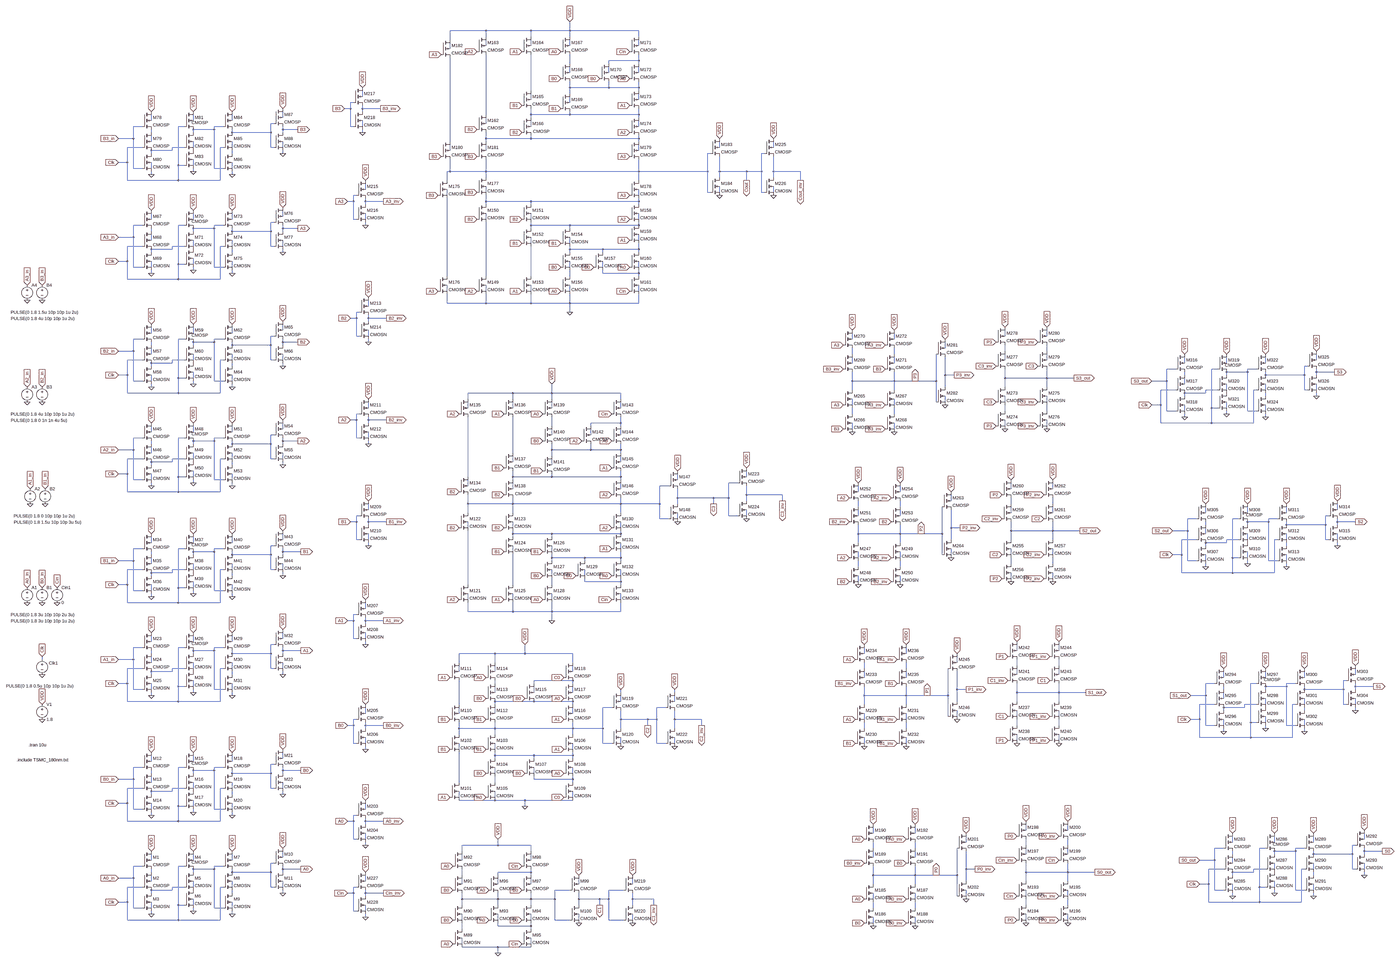
[diagram p0: schematic cla_adder_static_logic_optimized_1.asc, whole sheet]
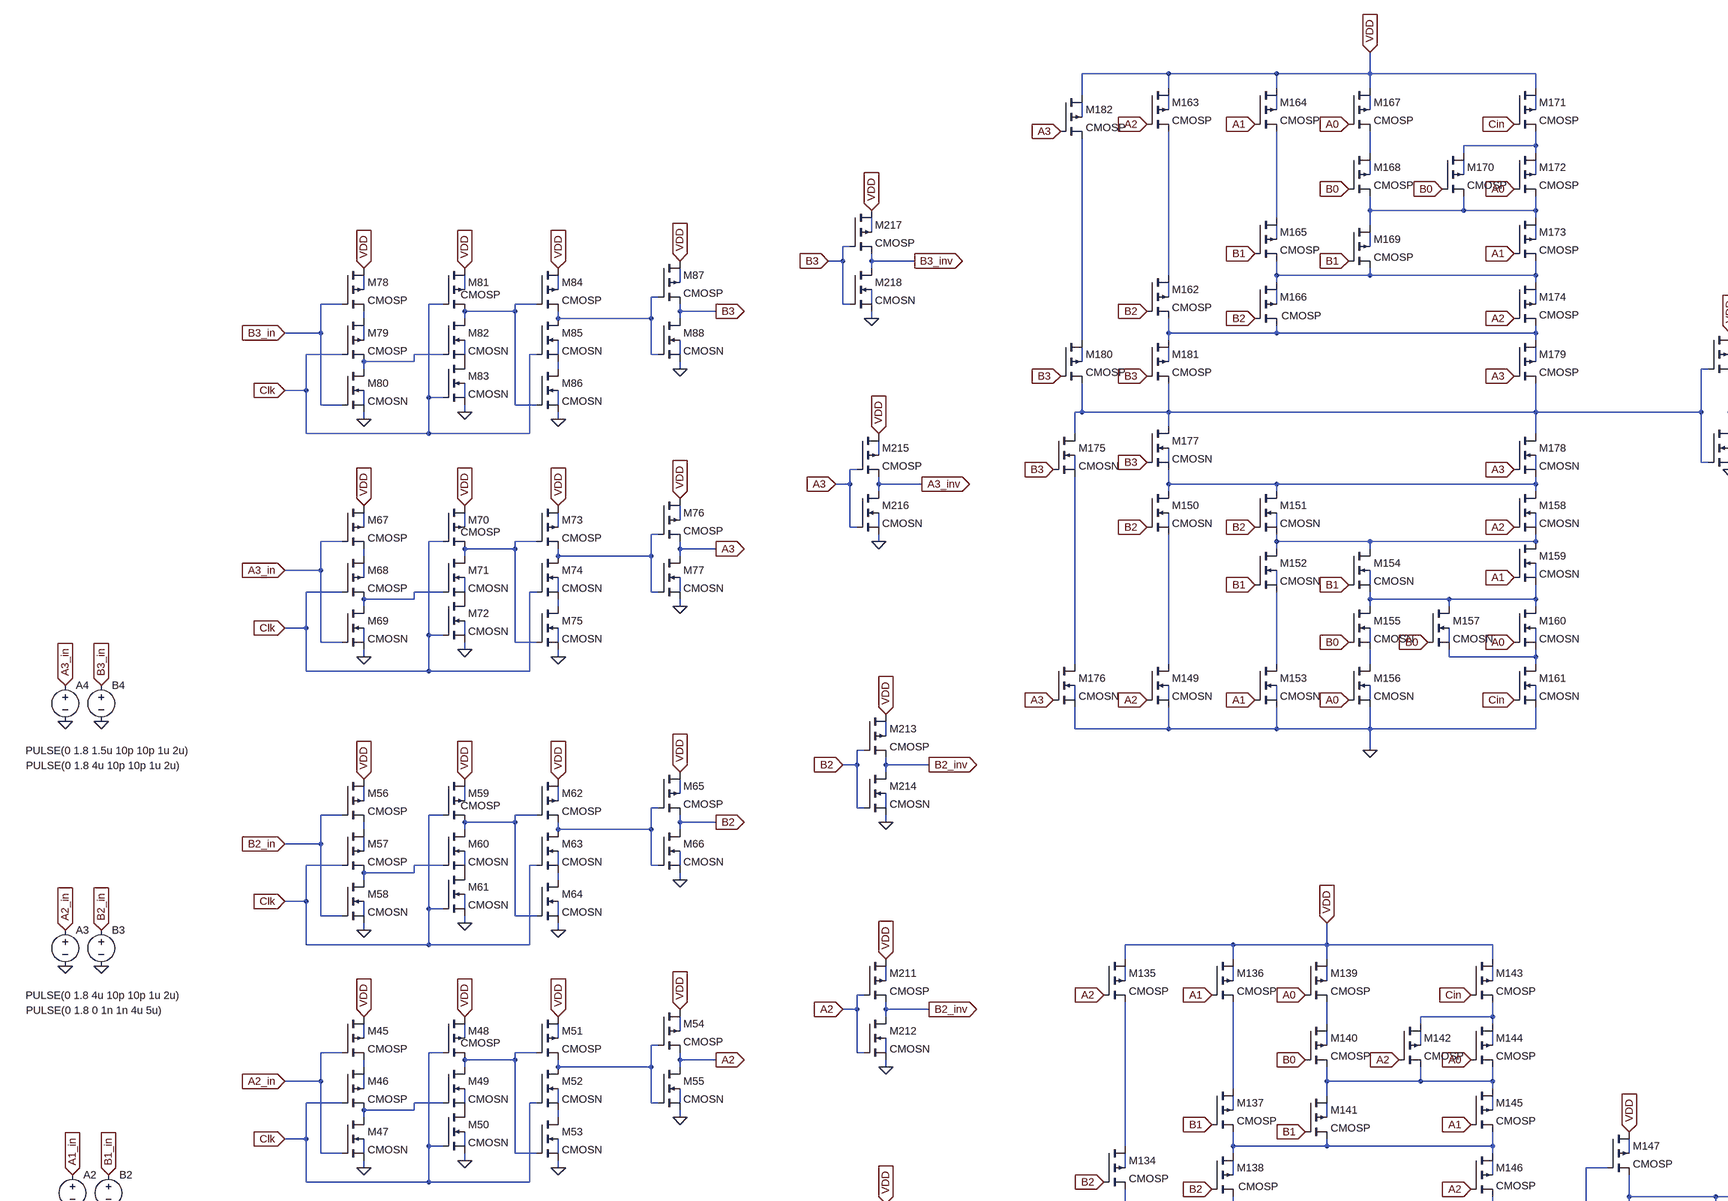
[diagram p1: schematic cla_adder_static_logic_optimized_1.asc, part, row 1 of 2, column 1 of 2]
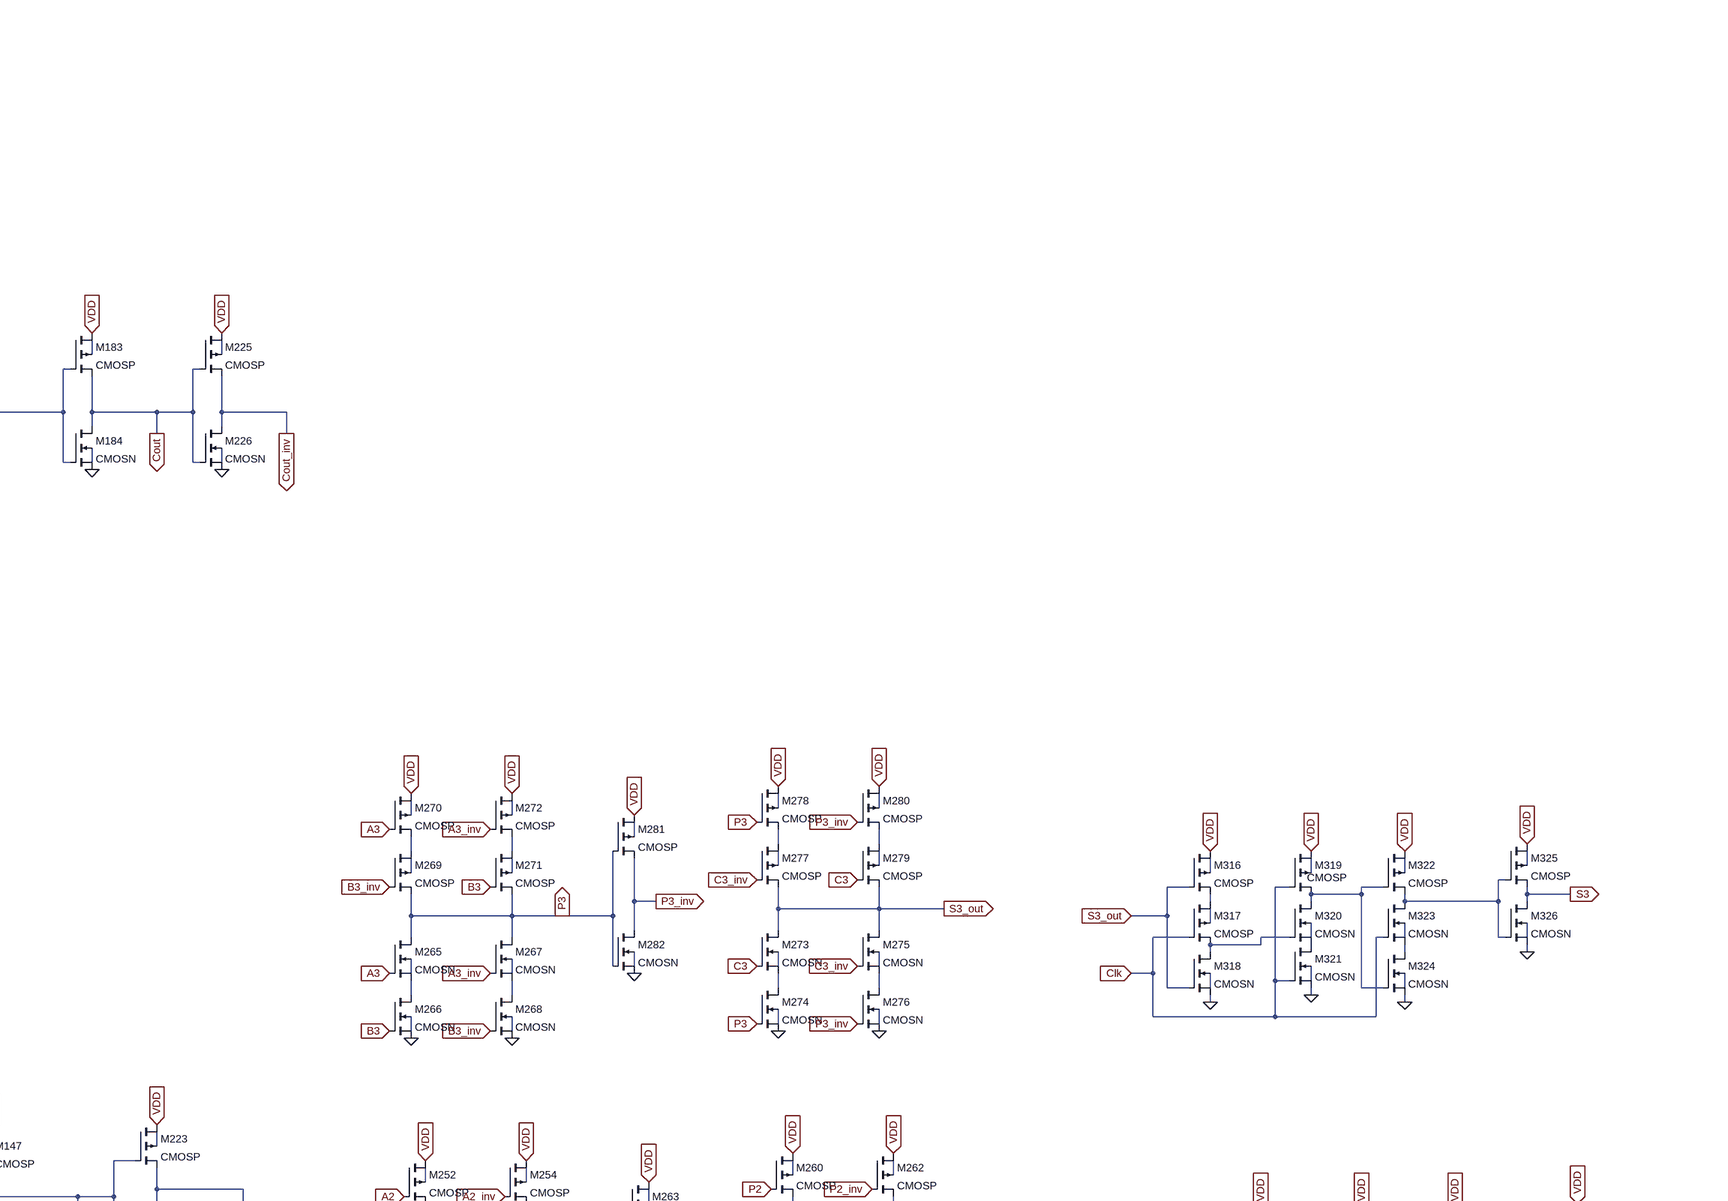
[diagram p2: schematic cla_adder_static_logic_optimized_1.asc, part, row 1 of 2, column 2 of 2]
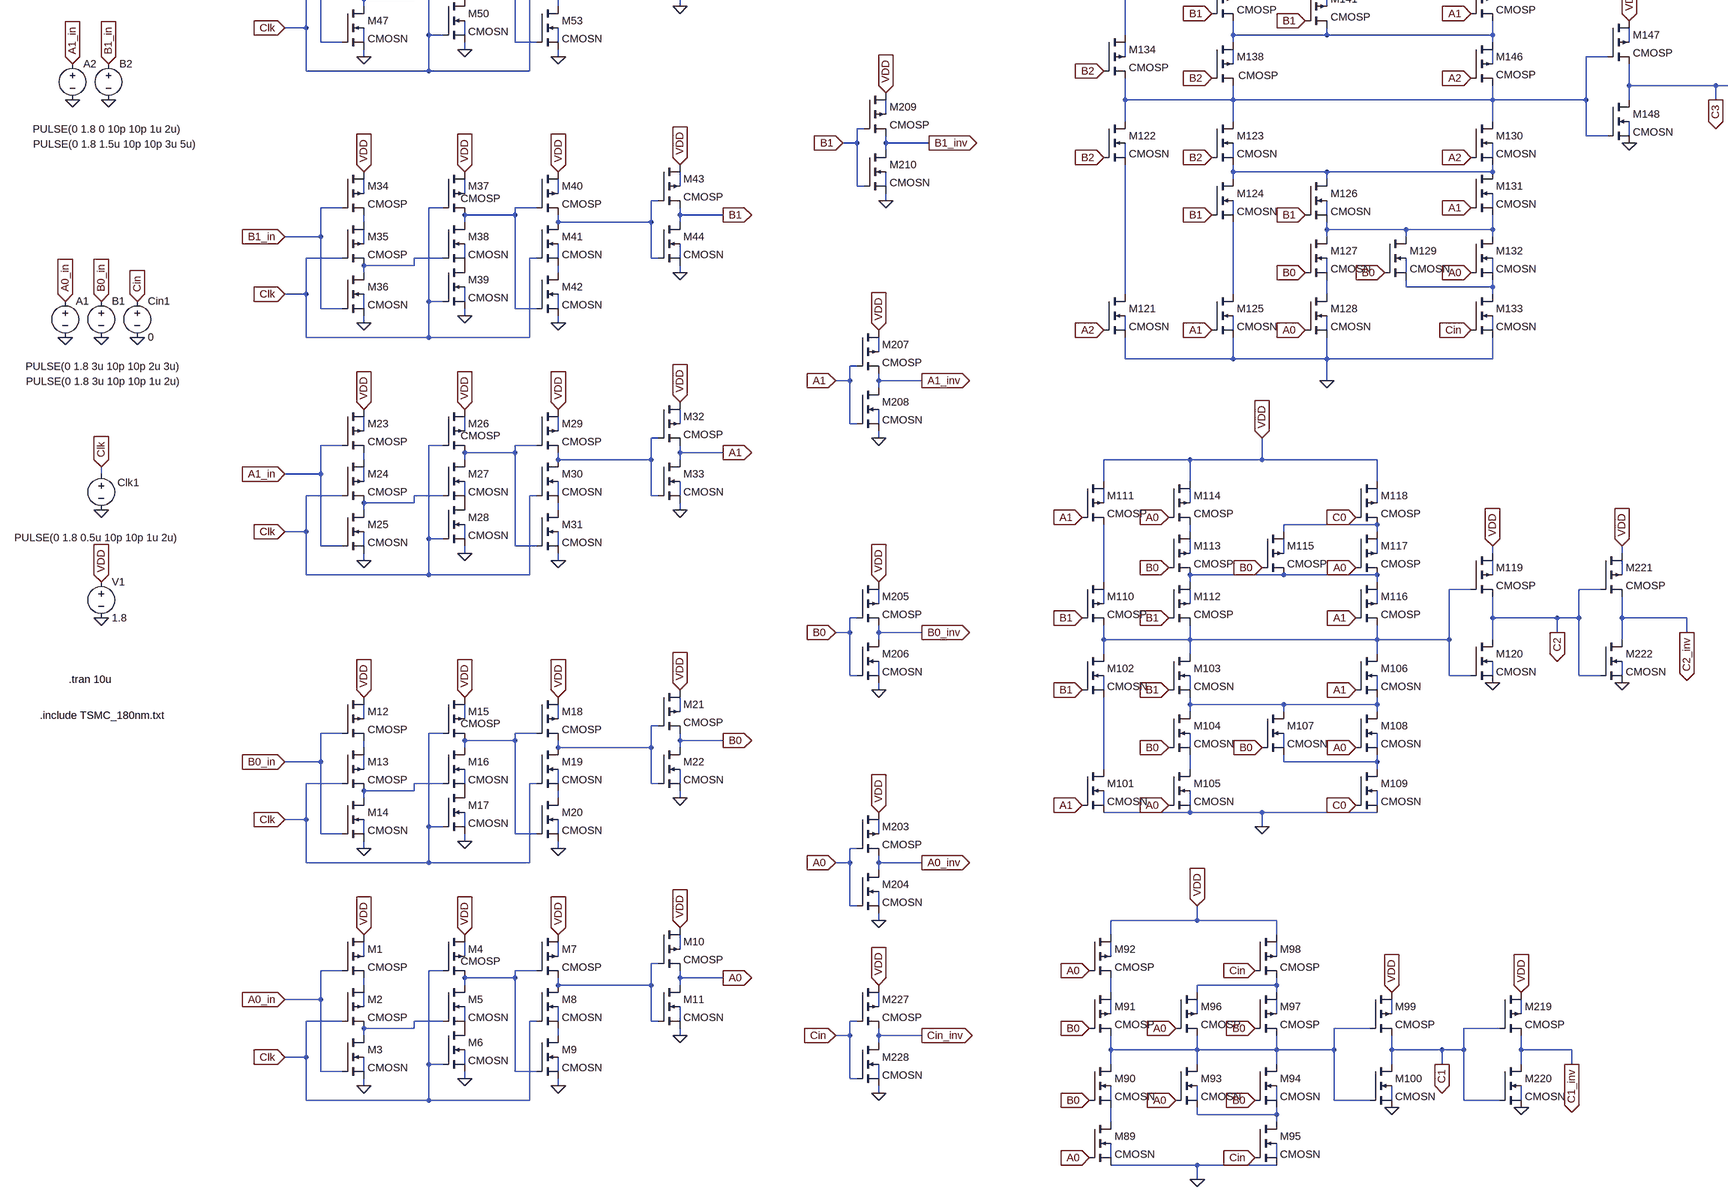
[diagram p3: schematic cla_adder_static_logic_optimized_1.asc, part, row 2 of 2, column 1 of 2]
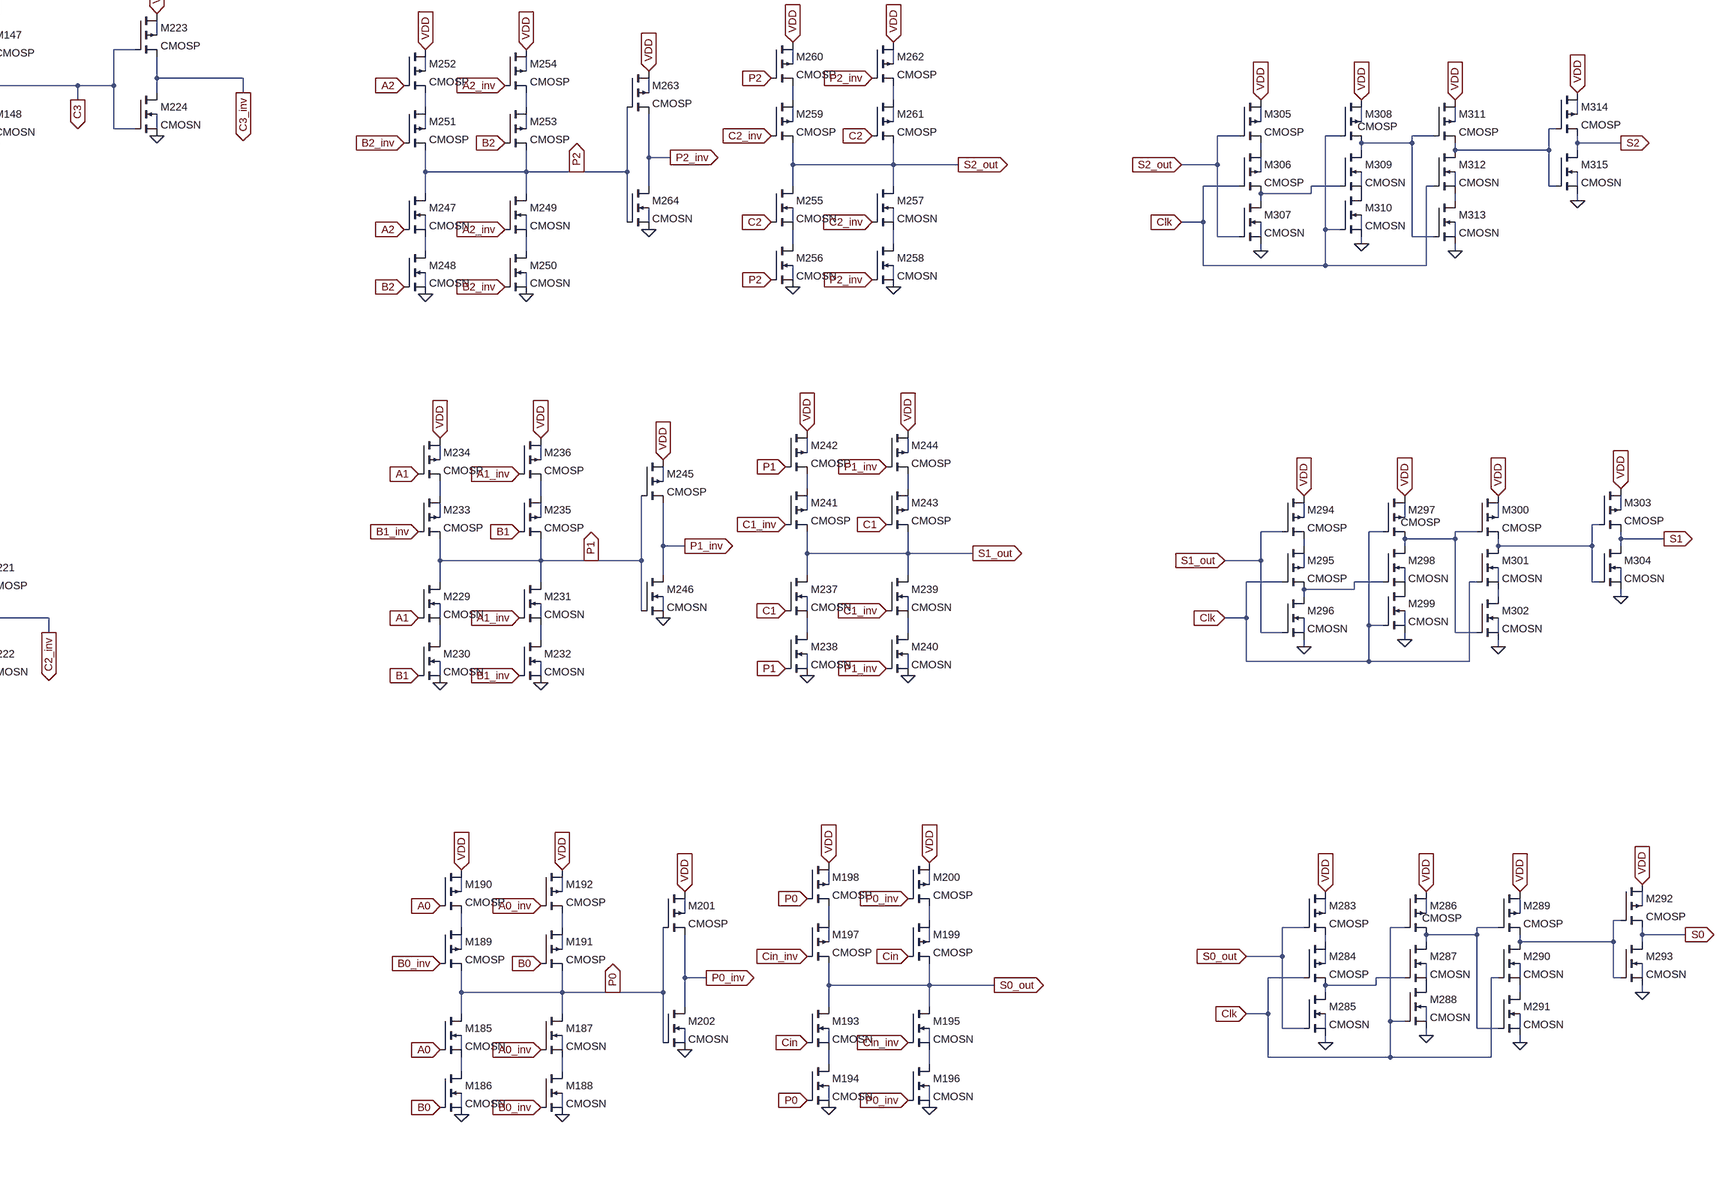
[diagram p4: schematic cla_adder_static_logic_optimized_1.asc, part, row 2 of 2, column 2 of 2]
* cla_adder_static_logic_optimized_1.asc
V§B1 B0_in 0 PULSE(0 1.8 3u 10p 10p 1u 2u)
V§Cin1 Cin 0 0
V§A1 A0_in 0 PULSE(0 1.8 3u 10p 10p 2u 3u)
V§B2 B1_in 0 PULSE(0 1.8 1.5u 10p 10p 3u 5u)
V§A2 A1_in 0 PULSE(0 1.8 0 10p 10p 1u 2u)
V§B3 B2_in 0 PULSE(0 1.8 0 1n 1n 4u 5u)
V§A3 A2_in 0 PULSE(0 1.8 4u 10p 10p 1u 2u)
V§B4 B3_in 0 PULSE(0 1.8 4u 10p 10p 1u 2u)
V§A4 A3_in 0 PULSE(0 1.8 1.5u 10p 10p 1u 2u)
V§Clk1 Clk 0 PULSE(0 1.8 0.5u 10p 10p 1u 2u)
V1 VDD 0 1.8
M1 VDD A0_in N417 N405 CMOSP l=0.18u w=3.6u
M2 N417 Clk N428 N421 CMOSP l=0.18u w=3.6u
M3 N428 A0_in 0 N445 CMOSN l=0.18u w=1.8u
M4 VDD Clk N412 N406 CMOSP l=0.18u w=3.6u
M5 N412 N428 P001 N429 CMOSN l=0.18u w=1.8u
M6 P001 Clk 0 N442 CMOSN l=0.18u w=1.8u
M7 VDD N412 N410 N407 CMOSP l=0.18u w=3.6u
M8 N410 Clk N436 N430 CMOSN l=0.18u w=1.8u
M9 N436 N412 0 N446 CMOSN l=0.18u w=1.8u
M10 VDD N410 A0 N402 CMOSP l=0.18u w=3.6u
M11 A0 N410 0 N431 CMOSN l=0.18u w=1.8u
M12 VDD B0_in N363 N358 CMOSP l=0.18u w=3.6u
M13 N363 Clk N371 N368 CMOSP l=0.18u w=3.6u
M14 N371 B0_in 0 N380 CMOSN l=0.18u w=1.8u
M15 VDD Clk N362 N359 CMOSP l=0.18u w=3.6u
M16 N362 N371 P002 N372 CMOSN l=0.18u w=1.8u
M17 P002 Clk 0 N379 CMOSN l=0.18u w=1.8u
M18 VDD N362 N361 N360 CMOSP l=0.18u w=3.6u
M19 N361 Clk N375 N373 CMOSN l=0.18u w=1.8u
M20 N375 N362 0 N381 CMOSN l=0.18u w=1.8u
M21 VDD N361 B0 N357 CMOSP l=0.18u w=3.6u
M22 B0 N361 0 N374 CMOSN l=0.18u w=1.8u
M23 VDD A1_in N283 N276 CMOSP l=0.18u w=3.6u
M24 N283 Clk N290 N286 CMOSP l=0.18u w=3.6u
M25 N290 A1_in 0 N313 CMOSN l=0.18u w=1.8u
M26 VDD Clk N280 N277 CMOSP l=0.18u w=3.6u
M27 N280 N290 P003 N291 CMOSN l=0.18u w=1.8u
M28 P003 Clk 0 N312 CMOSN l=0.18u w=1.8u
M29 VDD N280 N279 N278 CMOSP l=0.18u w=3.6u
M30 N279 Clk N299 N292 CMOSN l=0.18u w=1.8u
M31 N299 N280 0 N314 CMOSN l=0.18u w=1.8u
M32 VDD N279 A1 N274 CMOSP l=0.18u w=3.6u
M33 A1 N279 0 N293 CMOSN l=0.18u w=1.8u
M34 VDD B1_in N235 N226 CMOSP l=0.18u w=3.6u
M35 N235 Clk N250 N245 CMOSP l=0.18u w=3.6u
M36 N250 B1_in 0 N267 CMOSN l=0.18u w=1.8u
M37 VDD Clk N231 N227 CMOSP l=0.18u w=3.6u
M38 N231 N250 P004 N251 CMOSN l=0.18u w=1.8u
M39 P004 Clk 0 N266 CMOSN l=0.18u w=1.8u
M40 VDD N231 N229 N228 CMOSP l=0.18u w=3.6u
M41 N229 Clk N254 N252 CMOSN l=0.18u w=1.8u
M42 N254 N231 0 N268 CMOSN l=0.18u w=1.8u
M43 VDD N229 B1 N220 CMOSP l=0.18u w=3.6u
M44 B1 N229 0 N253 CMOSN l=0.18u w=1.8u
M45 VDD A2_in N169 N160 CMOSP l=0.18u w=3.6u
M46 N169 Clk N173 N171 CMOSP l=0.18u w=3.6u
M47 N173 A2_in 0 N185 CMOSN l=0.18u w=1.8u
M48 VDD Clk N167 N161 CMOSP l=0.18u w=3.6u
M49 N167 N173 P005 N174 CMOSN l=0.18u w=1.8u
M50 P005 Clk 0 N181 CMOSN l=0.18u w=1.8u
M51 VDD N167 N163 N162 CMOSP l=0.18u w=3.6u
M52 N163 Clk N179 N175 CMOSN l=0.18u w=1.8u
M53 N179 N167 0 N186 CMOSN l=0.18u w=1.8u
M54 VDD N163 A2 N157 CMOSP l=0.18u w=3.6u
M55 A2 N163 0 N176 CMOSN l=0.18u w=1.8u
M56 VDD B2_in N104 N094 CMOSP l=0.18u w=3.6u
M57 N104 Clk N111 N108 CMOSP l=0.18u w=3.6u
M58 N111 B2_in 0 N128 CMOSN l=0.18u w=1.8u
M59 VDD Clk N101 N095 CMOSP l=0.18u w=3.6u
M60 N101 N111 P006 N112 CMOSN l=0.18u w=1.8u
M61 P006 Clk 0 N127 CMOSN l=0.18u w=1.8u
M62 VDD N101 N097 N096 CMOSP l=0.18u w=3.6u
M63 N097 Clk N123 N113 CMOSN l=0.18u w=1.8u
M64 N123 N101 0 N129 CMOSN l=0.18u w=1.8u
M65 VDD N097 B2 N093 CMOSP l=0.18u w=3.6u
M66 B2 N097 0 N114 CMOSN l=0.18u w=1.8u
M67 VDD A3_in N065 N055 CMOSP l=0.18u w=3.6u
M68 N065 Clk N070 N066 CMOSP l=0.18u w=3.6u
M69 N070 A3_in 0 N077 CMOSN l=0.18u w=1.8u
M70 VDD Clk N063 N056 CMOSP l=0.18u w=3.6u
M71 N063 N070 P007 N071 CMOSN l=0.18u w=1.8u
M72 P007 Clk 0 N076 CMOSN l=0.18u w=1.8u
M73 VDD N063 N062 N057 CMOSP l=0.18u w=3.6u
M74 N062 Clk N075 N072 CMOSN l=0.18u w=1.8u
M75 N075 N063 0 N078 CMOSN l=0.18u w=1.8u
M76 VDD N062 A3 N054 CMOSP l=0.18u w=3.6u
M77 A3 N062 0 N073 CMOSN l=0.18u w=1.8u
M78 VDD B3_in N029 N020 CMOSP l=0.18u w=3.6u
M79 N029 Clk N033 N031 CMOSP l=0.18u w=3.6u
M80 N033 B3_in 0 N045 CMOSN l=0.18u w=1.8u
M81 VDD Clk N025 N021 CMOSP l=0.18u w=3.6u
M82 N025 N033 P008 N034 CMOSN l=0.18u w=1.8u
M83 P008 Clk 0 N044 CMOSN l=0.18u w=1.8u
M84 VDD N025 N023 N022 CMOSP l=0.18u w=3.6u
M85 N023 Clk N042 N035 CMOSN l=0.18u w=1.8u
M86 N042 N025 0 N046 CMOSN l=0.18u w=1.8u
M87 VDD N023 B3 N019 CMOSP l=0.18u w=3.6u
M88 B3 N023 0 N036 CMOSN l=0.18u w=1.8u
M89 N460 A0 0 N461 CMOSN l=0.18u w=3.6u
M90 N433 B0 N460 N450 CMOSN l=0.18u w=3.6u
M91 N419 B0 N433 N423 CMOSP l=0.18u w=7.2u
M92 VDD A0 N419 N408 CMOSP l=0.18u w=7.2u
M93 N433 A0 N459 N451 CMOSN l=0.18u w=3.6u
M94 N433 B0 N459 N452 CMOSN l=0.18u w=3.6u
M95 N459 Cin 0 N462 CMOSN l=0.18u w=3.6u
M96 N418 A0 N433 N424 CMOSP l=0.18u w=7.2u
M97 N418 B0 N433 N425 CMOSP l=0.18u w=7.2u
M98 VDD Cin N418 N409 CMOSP l=0.18u w=7.2u
M99 VDD N433 C1 N426 CMOSP l=0.18u w=3.6u
M100 C1 N433 0 N453 CMOSN l=0.18u w=1.8u
M101 N369 A1 0 N376 CMOSN l=0.18u w=3.6u
M102 N328 B1 N369 N353 CMOSN l=0.18u w=3.6u
M103 N328 B1 N356 N354 CMOSN l=0.18u w=3.6u
M104 N356 B0 N370 N364 CMOSN l=0.18u w=3.6u
M105 N370 A0 0 N377 CMOSN l=0.18u w=3.6u
M106 N328 A1 N356 N355 CMOSN l=0.18u w=3.6u
M107 N356 B0 N367 N365 CMOSN l=0.18u w=3.6u
M108 N356 A0 N367 N366 CMOSN l=0.18u w=3.6u
M109 N367 C0 0 N378 CMOSN l=0.18u w=3.6u
M110 N323 B1 N328 N331 CMOSP l=0.18u w=7.2u
M111 VDD A1 N323 N296 CMOSP l=0.18u w=7.2u
M112 N320 B1 N328 N332 CMOSP l=0.18u w=7.2u
M113 N310 B0 N320 N316 CMOSP l=0.18u w=7.2u
M114 VDD A0 N310 N297 CMOSP l=0.18u w=7.2u
M115 N308 B0 N320 N317 CMOSP l=0.18u w=7.2u
M116 N320 A1 N328 N333 CMOSP l=0.18u w=7.2u
M117 N308 A0 N320 N318 CMOSP l=0.18u w=7.2u
M118 VDD C0 N308 N298 CMOSP l=0.18u w=7.2u
M119 VDD N328 C2 N321 CMOSP l=0.18u w=3.6u
M120 C2 N328 0 N349 CMOSN l=0.18u w=1.8u
M121 N263 A2 0 N269 CMOSN l=0.18u w=3.6u
M122 N189 B2 N263 N215 CMOSN l=0.18u w=3.6u
M123 N189 B2 N218 N216 CMOSN l=0.18u w=3.6u
M124 N218 B1 N264 N233 CMOSN l=0.18u w=3.6u
M125 N264 A1 0 N270 CMOSN l=0.18u w=3.6u
M126 N218 B1 N239 N234 CMOSN l=0.18u w=3.6u
M127 N239 B0 N265 N255 CMOSN l=0.18u w=3.6u
M128 N265 A0 0 N271 CMOSN l=0.18u w=3.6u
M129 N239 B0 N260 N256 CMOSN l=0.18u w=3.6u
M130 N189 A2 N218 N217 CMOSN l=0.18u w=3.6u
M131 N218 A1 N239 N232 CMOSN l=0.18u w=3.6u
M132 N239 A0 N260 N257 CMOSN l=0.18u w=3.6u
M133 N260 Cin 0 N272 CMOSN l=0.18u w=3.6u
M134 N182 B2 N189 N188 CMOSP l=0.18u w=1.8u
M135 VDD A2 N182 N142 CMOSP l=0.18u w=7.2u
M136 VDD A1 N172 N143 CMOSP l=0.18u w=1.8u
M137 N172 B1 N183 N177 CMOSP l=0.18u w=7.2u
M138 N183 B2 N189 N190 CMOSP l=0.18u w=7.2u
M139 VDD A0 N154 N144 CMOSP l=0.18u w=7.2u
M140 N154 B0 N170 N164 CMOSP l=0.18u w=7.2u
M141 N170 B1 N183 N180 CMOSP l=0.18u w=7.2u
M142 N153 A2 N170 N165 CMOSP l=0.18u w=7.2u
M143 VDD Cin N153 N145 CMOSP l=0.18u w=7.2u
M144 N153 A0 N170 N166 CMOSP l=0.18u w=7.2u
M145 N170 A1 N183 N178 CMOSP l=0.18u w=7.2u
M146 N183 A2 N189 N191 CMOSP l=0.18u w=7.2u
M147 VDD N189 C3 N187 CMOSP l=0.18u w=3.6u
M148 C3 N189 0 N212 CMOSN l=0.18u w=1.8u
M149 N084 A2 0 N088 CMOSN l=0.18u w=3.6u
M150 N053 B2 N084 N059 CMOSN l=0.18u w=3.6u
M151 N053 B2 N064 N060 CMOSN l=0.18u w=3.6u
M152 N064 B1 N085 N068 CMOSN l=0.18u w=3.6u
M153 N085 A1 0 N089 CMOSN l=0.18u w=3.6u
M154 N064 B1 N074 N069 CMOSN l=0.18u w=3.6u
M155 N074 B0 N086 N079 CMOSN l=0.18u w=3.6u
M156 N086 A0 0 N090 CMOSN l=0.18u w=3.6u
M157 N074 B0 N082 N080 CMOSN l=0.18u w=3.6u
M158 N053 A2 N064 N061 CMOSN l=0.18u w=3.6u
M159 N064 A1 N074 N067 CMOSN l=0.18u w=3.6u
M160 N074 A0 N082 N081 CMOSN l=0.18u w=3.6u
M161 N082 Cin 0 N091 CMOSN l=0.18u w=3.6u
M162 N017 B2 N030 N024 CMOSP l=0.18u w=1.8u
M163 VDD A2 N017 N001 CMOSP l=0.18u w=7.2u
M164 VDD A1 N012 N002 CMOSP l=0.18u w=1.8u
M165 N012 B1 N018 N014 CMOSP l=0.18u w=7.2u
M166 N018 B2 N030 N027 CMOSP l=0.18u w=7.2u
M167 VDD A0 N007 N003 CMOSP l=0.18u w=7.2u
M168 N007 B0 N011 N008 CMOSP l=0.18u w=7.2u
M169 N011 B1 N018 N016 CMOSP l=0.18u w=7.2u
M170 N006 B0 N011 N009 CMOSP l=0.18u w=7.2u
M171 VDD Cin N006 N004 CMOSP l=0.18u w=7.2u
M172 N006 A0 N011 N010 CMOSP l=0.18u w=7.2u
M173 N011 A1 N018 N015 CMOSP l=0.18u w=7.2u
M174 N018 A2 N030 N028 CMOSP l=0.18u w=7.2u
M175 N043 B3 N083 N051 CMOSN l=0.18u w=3.6u
M176 N083 A3 0 N087 CMOSN l=0.18u w=3.6u
M177 N043 B3 N053 N048 CMOSN l=0.18u w=3.6u
M178 N043 A3 N053 N052 CMOSN l=0.18u w=3.6u
M179 N030 A3 N043 N041 CMOSP l=0.18u w=7.2u
M181 N030 B3 N043 N040 CMOSP l=0.18u w=7.2u
M180 N032 B3 N043 N039 CMOSP l=0.18u w=7.2u
M182 VDD A3 N032 N005 CMOSP l=0.18u w=7.2u
M183 VDD N043 Cout N037 CMOSP l=0.18u w=3.6u
M184 Cout N043 0 N049 CMOSN l=0.18u w=1.8u
M219 VDD C1 C1_inv N427 CMOSP l=0.18u w=3.6u
M220 C1_inv C1 0 N454 CMOSN l=0.18u w=1.8u
M221 VDD C2 C2_inv N322 CMOSP l=0.18u w=3.6u
M222 C2_inv C2 0 N350 CMOSN l=0.18u w=1.8u
M223 VDD C3 C3_inv N184 CMOSP l=0.18u w=3.6u
M224 C3_inv C3 0 N208 CMOSN l=0.18u w=1.8u
M225 VDD Cout Cout_inv N038 CMOSP l=0.18u w=3.6u
M226 Cout_inv Cout 0 N050 CMOSN l=0.18u w=1.8u
M185 P0 A0 N447 N440 CMOSN l=0.18u w=3.6u
M186 N447 B0 0 N457 CMOSN l=0.18u w=3.6u
M187 P0 A0_inv N448 N441 CMOSN l=0.18u w=3.6u
M188 N448 B0_inv 0 N458 CMOSN l=0.18u w=3.6u
M189 N396 B0_inv P0 N403 CMOSP l=0.18u w=7.2u
M190 VDD A0 N396 N385 CMOSP l=0.18u w=7.2u
M191 N397 B0 P0 N404 CMOSP l=0.18u w=7.2u
M192 VDD A0_inv N397 N386 CMOSP l=0.18u w=7.2u
M193 S0_out Cin N443 N438 CMOSN l=0.18u w=3.6u
M194 N443 P0 0 N455 CMOSN l=0.18u w=3.6u
M195 S0_out Cin_inv N444 N439 CMOSN l=0.18u w=3.6u
M196 N444 P0_inv 0 N456 CMOSN l=0.18u w=3.6u
M197 N393 Cin_inv S0_out N399 CMOSP l=0.18u w=7.2u
M198 VDD P0 N393 N383 CMOSP l=0.18u w=7.2u
M199 N394 Cin S0_out N400 CMOSP l=0.18u w=7.2u
M200 VDD P0_inv N394 N384 CMOSP l=0.18u w=7.2u
M201 VDD P0 P0_inv N389 CMOSP l=0.18u w=3.6u
M202 P0_inv P0 0 N437 CMOSN l=0.18u w=1.8u
M203 VDD A0 A0_inv N382 CMOSP l=0.18u w=3.6u
M204 A0_inv A0 0 N387 CMOSN l=0.18u w=1.8u
M205 VDD B0 B0_inv N330 CMOSP l=0.18u w=3.6u
M206 B0_inv B0 0 N348 CMOSN l=0.18u w=1.8u
M207 VDD A1 A1_inv N273 CMOSP l=0.18u w=3.6u
M208 A1_inv A1 0 N275 CMOSN l=0.18u w=1.8u
M209 VDD B1 B1_inv N201 CMOSP l=0.18u w=3.6u
M210 B1_inv B1 0 N221 CMOSN l=0.18u w=1.8u
M211 VDD A2 B2_inv N141 CMOSP l=0.18u w=3.6u
M212 B2_inv A2 0 N168 CMOSN l=0.18u w=1.8u
M213 VDD B2 B2_inv N092 CMOSP l=0.18u w=3.6u
M214 B2_inv B2 0 N098 CMOSN l=0.18u w=1.8u
M215 VDD A3 A3_inv N047 CMOSP l=0.18u w=3.6u
M216 A3_inv A3 0 N058 CMOSN l=0.18u w=1.8u
M217 VDD B3 B3_inv N013 CMOSP l=0.18u w=3.6u
M218 B3_inv B3 0 N026 CMOSN l=0.18u w=1.8u
M227 VDD Cin Cin_inv N422 CMOSP l=0.18u w=3.6u
M228 Cin_inv Cin 0 N449 CMOSN l=0.18u w=1.8u
M229 P1 A1 N344 N337 CMOSN l=0.18u w=3.6u
M230 N344 B1 0 N351 CMOSN l=0.18u w=3.6u
M231 P1 A1_inv N345 N338 CMOSN l=0.18u w=3.6u
M232 N345 B1_inv 0 N352 CMOSN l=0.18u w=3.6u
M233 N294 B1_inv P1 N303 CMOSP l=0.18u w=7.2u
M234 VDD A1 N294 N284 CMOSP l=0.18u w=7.2u
M235 N295 B1 P1 N304 CMOSP l=0.18u w=7.2u
M236 VDD A1_inv N295 N285 CMOSP l=0.18u w=7.2u
M237 S1_out C1 N340 N335 CMOSN l=0.18u w=3.6u
M238 N340 P1 0 N346 CMOSN l=0.18u w=3.6u
M239 S1_out C1_inv N341 N336 CMOSN l=0.18u w=3.6u
M240 N341 P1_inv 0 N347 CMOSN l=0.18u w=3.6u
M241 N288 C1_inv S1_out N300 CMOSP l=0.18u w=7.2u
M242 VDD P1 N288 N281 CMOSP l=0.18u w=7.2u
M243 N289 C1 S1_out N301 CMOSP l=0.18u w=7.2u
M244 VDD P1_inv N289 N282 CMOSP l=0.18u w=7.2u
M245 VDD P1 P1_inv N287 CMOSP l=0.18u w=3.6u
M246 P1_inv P1 0 N334 CMOSN l=0.18u w=1.8u
M247 P2 A2 N248 N240 CMOSN l=0.18u w=3.6u
M248 N248 B2 0 N261 CMOSN l=0.18u w=3.6u
M249 P2 A2_inv N249 N241 CMOSN l=0.18u w=3.6u
M250 N249 B2_inv 0 N262 CMOSN l=0.18u w=3.6u
M251 N199 B2_inv P2 N209 CMOSP l=0.18u w=7.2u
M252 VDD A2 N199 N194 CMOSP l=0.18u w=7.2u
M253 N200 B2 P2 N210 CMOSP l=0.18u w=7.2u
M254 VDD A2_inv N200 N195 CMOSP l=0.18u w=7.2u
M255 S2_out C2 N246 N237 CMOSN l=0.18u w=3.6u
M256 N246 P2 0 N258 CMOSN l=0.18u w=3.6u
M257 S2_out C2_inv N247 N238 CMOSN l=0.18u w=3.6u
M258 N247 P2_inv 0 N259 CMOSN l=0.18u w=3.6u
M259 N197 C2_inv S2_out N203 CMOSP l=0.18u w=7.2u
M260 VDD P2 N197 N192 CMOSP l=0.18u w=7.2u
M261 N198 C2 S2_out N204 CMOSP l=0.18u w=7.2u
M262 VDD P2_inv N198 N193 CMOSP l=0.18u w=7.2u
M263 VDD P2 P2_inv N196 CMOSP l=0.18u w=3.6u
M264 P2_inv P2 0 N236 CMOSN l=0.18u w=1.8u
M265 P3 A3 N151 N139 CMOSN l=0.18u w=3.6u
M266 N151 B3 0 N158 CMOSN l=0.18u w=3.6u
M267 P3 A3_inv N152 N140 CMOSN l=0.18u w=3.6u
M268 N152 B3_inv 0 N159 CMOSN l=0.18u w=3.6u
M269 N109 B3_inv P3 N118 CMOSP l=0.18u w=7.2u
M270 VDD A3 N109 N102 CMOSP l=0.18u w=7.2u
M271 N110 B3 P3 N119 CMOSP l=0.18u w=7.2u
M272 VDD A3_inv N110 N103 CMOSP l=0.18u w=7.2u
M273 S3_out C3 N147 N137 CMOSN l=0.18u w=3.6u
M274 N147 P3 0 N155 CMOSN l=0.18u w=3.6u
M275 S3_out C3_inv N148 N138 CMOSN l=0.18u w=3.6u
M276 N148 P3_inv 0 N156 CMOSN l=0.18u w=3.6u
M277 N106 C3_inv S3_out N115 CMOSP l=0.18u w=7.2u
M278 VDD P3 N106 N099 CMOSP l=0.18u w=7.2u
M279 N107 C3 S3_out N116 CMOSP l=0.18u w=7.2u
M280 VDD P3_inv N107 N100 CMOSP l=0.18u w=7.2u
M281 VDD P3 P3_inv N105 CMOSP l=0.18u w=3.6u
M282 P3_inv P3 0 N136 CMOSN l=0.18u w=1.8u
M283 VDD S0_out N401 N390 CMOSP l=0.18u w=3.6u
M284 N401 Clk N413 N411 CMOSP l=0.18u w=3.6u
M285 N413 S0_out 0 N434 CMOSN l=0.18u w=1.8u
M286 VDD Clk N398 N391 CMOSP l=0.18u w=3.6u
M287 N398 N413 P009 N414 CMOSN l=0.18u w=1.8u
M288 P009 Clk 0 N432 CMOSN l=0.18u w=1.8u
M289 VDD N398 N395 N392 CMOSP l=0.18u w=3.6u
M290 N395 Clk N420 N415 CMOSN l=0.18u w=1.8u
M291 N420 N398 0 N435 CMOSN l=0.18u w=1.8u
M292 VDD N395 S0 N388 CMOSP l=0.18u w=3.6u
M293 S0 N395 0 N416 CMOSN l=0.18u w=1.8u
M294 VDD S1_out N315 N305 CMOSP l=0.18u w=3.6u
M295 N315 Clk N324 N319 CMOSP l=0.18u w=3.6u
M296 N324 S1_out 0 N342 CMOSN l=0.18u w=1.8u
M297 VDD Clk N311 N306 CMOSP l=0.18u w=3.6u
M298 N311 N324 P010 N325 CMOSN l=0.18u w=1.8u
M299 P010 Clk 0 N339 CMOSN l=0.18u w=1.8u
M300 VDD N311 N309 N307 CMOSP l=0.18u w=3.6u
M301 N309 Clk N329 N326 CMOSN l=0.18u w=1.8u
M302 N329 N311 0 N343 CMOSN l=0.18u w=1.8u
M303 VDD N309 S1 N302 CMOSP l=0.18u w=3.6u
M304 S1 N309 0 N327 CMOSN l=0.18u w=1.8u
M305 VDD S2_out N214 N205 CMOSP l=0.18u w=3.6u
M306 N214 Clk N222 N219 CMOSP l=0.18u w=3.6u
M307 N222 S2_out 0 N243 CMOSN l=0.18u w=1.8u
M308 VDD Clk N213 N206 CMOSP l=0.18u w=3.6u
M309 N213 N222 P011 N223 CMOSN l=0.18u w=1.8u
M310 P011 Clk 0 N242 CMOSN l=0.18u w=1.8u
M311 VDD N213 N211 N207 CMOSP l=0.18u w=3.6u
M312 N211 Clk N230 N224 CMOSN l=0.18u w=1.8u
M313 N230 N213 0 N244 CMOSN l=0.18u w=1.8u
M314 VDD N211 S2 N202 CMOSP l=0.18u w=3.6u
M315 S2 N211 0 N225 CMOSN l=0.18u w=1.8u
M316 VDD S3_out N126 N120 CMOSP l=0.18u w=3.6u
M317 N126 Clk N131 N130 CMOSP l=0.18u w=3.6u
M318 N131 S3_out 0 N149 CMOSN l=0.18u w=1.8u
M319 VDD Clk N125 N121 CMOSP l=0.18u w=3.6u
M320 N125 N131 P012 N132 CMOSN l=0.18u w=1.8u
M321 P012 Clk 0 N146 CMOSN l=0.18u w=1.8u
M322 VDD N125 N124 N122 CMOSP l=0.18u w=3.6u
M323 N124 Clk N135 N133 CMOSN l=0.18u w=1.8u
M324 N135 N125 0 N150 CMOSN l=0.18u w=1.8u
M325 VDD N124 S3 N117 CMOSP l=0.18u w=3.6u
M326 S3 N124 0 N134 CMOSN l=0.18u w=1.8u
.model NMOS NMOS
.model PMOS PMOS
.lib standard.mos
.tran 10u
.include TSMC_180nm.txt
.backanno
.end